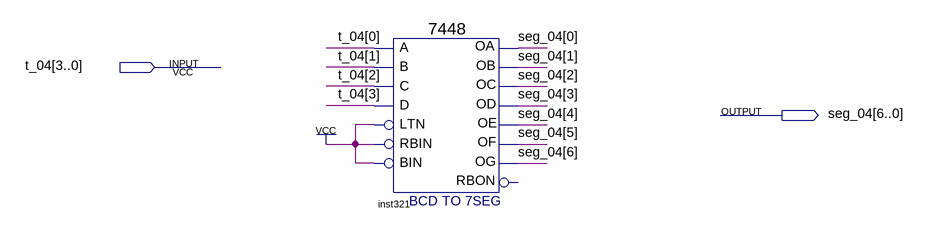
[diagram p0: schematic sheet]
// Quartus schematic decoder.bdf as structural Verilog: 1 symbols, 2 pins
module decoder (
  input  [3:0] t_04,
  output [6:0] seg_04
);

  \7448  inst321 (
    .A(t_04[0]), .C(t_04[2]), .D(t_04[3]), .B(t_04[1]), .RBIN(1'b1), .BIN(1'b1), .LTN(1'b1), .OC(seg_04[2]),
    .OE(seg_04[4]), .OD(seg_04[3]), .OF(seg_04[5]), .OG(seg_04[6]), .OB(seg_04[1]), .OA(seg_04[0]));  // open: RBON
endmodule
